# EAGLE design OpenBarbell3b2 (EAGLE 7.3.0)
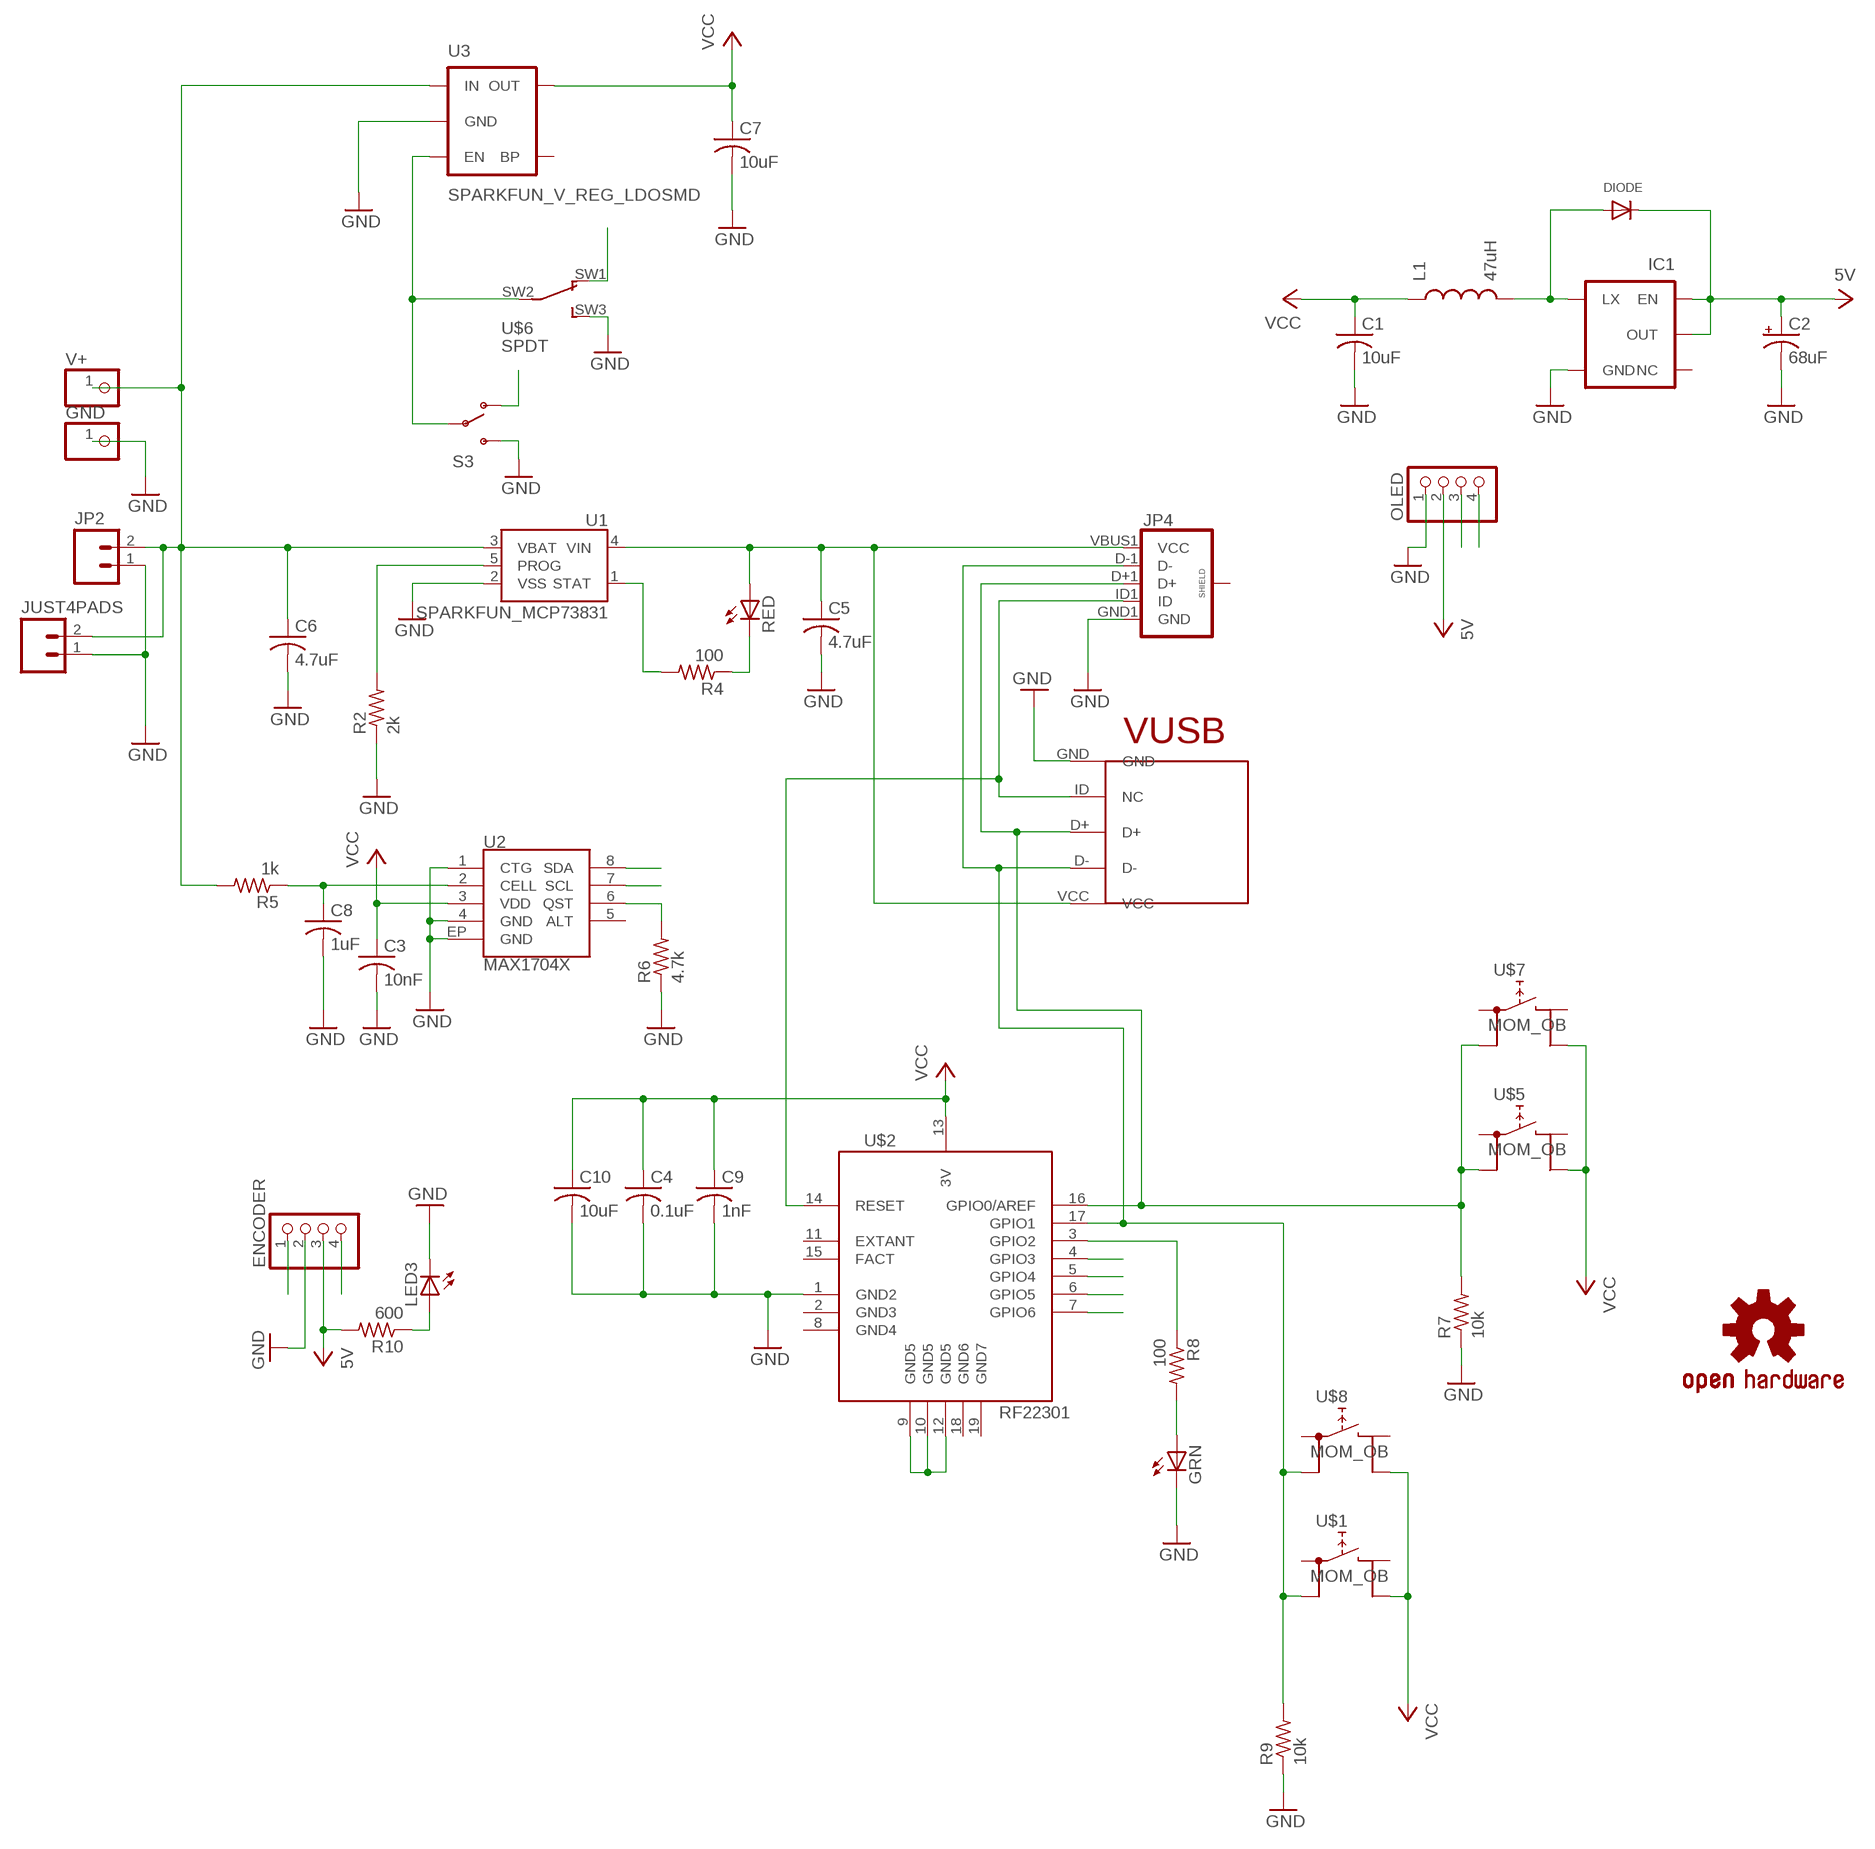
[diagram p0: schematic, sheet 1]

## Parts
C1  10uF  C-USC0805  [C0805]
C2  68uF  SPARKFUN_CAP_POL3528  [SPARKFUN_EIA3528]
C3  10nF  C-USC0805  [C0805]
C4  0.1uF  C-USC0805  [C0805]
C5  4.7uF  C-USC0805  [C0805]
C6  4.7uF  C-USC0805  [C0805]
C7  10uF  C-USC0805  [C0805]
C8  1uF  C-USC0805  [C0805]
C9  1nF  C-USC0805  [C0805]
C10  10uF  C-USC0805  [C0805]
DIODE  DIODESOD-123  [SOD-123]
ENCODER  PINHD-1X3CB  [1X03-CLEANBIG]
GND  PINHD-1X1  [1X01]
GRN  LEDCHIPLED_0805  [CHIPLED_0805]
IC1  SPARKFUN_V_REG_NCP1400SOT23-5  [SPARKFUN_SOT23-5]
JP2  SPARKFUN_M02-JST-2MM-SMT  [SPARKFUN_JST-2-SMD]
JP4  USB_MICROB_PLUGCONN-11752  [USB-B-MICRO-SMD_V03]
JUST4PADS  SPARKFUN_M02-JST-2MM-SMT  [SPARKFUN_JST-2-SMD]
L1  47uH  SPARKFUN_INDUCTORCR54  [SPARKFUN_CR54]
LED3  LED3MM  [LED3MM]
OLED  PINHD-1X3CB  [1X03-CLEANBIG]
R2  2k  R-US_R0805  [R0805]
R4  100  R-US_R0805  [R0805]
R5  1k  R-US_R0805  [R0805]
R6  4.7k  R-US_R0805  [R0805]
R7  10k  R-US_R0805  [R0805]
R8  100  R-US_R0805  [R0805]
R9  10k  R-US_R0805  [R0805]
R10  600  R-US_R0805  [R0805]
RED  LEDCHIPLED_0805  [CHIPLED_0805]
S3  SWITCH-SPDTSMD2  [SWITCH-SPDT-SMD]
U1  SPARKFUN_MCP73831  [SPARKFUN_SOT23-5]
U2  MAX1704X  [TDFN-8]
U3  SPARKFUN_V_REG_LDOSMD  [SPARKFUN_SOT23-5]
U$1  MOM_OB  [MOM_]
U$2  RF22301  [RFD22301]
U$3  USB-MICRO-B-VERTICAL_SMD  [USB-MICRO-B-VERTICAL-SMD]
U$4  SPARKFUN_OSHW-LOGOL  [SPARKFUN_OSHW-LOGO-L]
U$5  MOM_OB  [MOM_]
U$6  SPDT  [SPDT]
U$7  MOM_OB  [MOM_]
U$8  MOM_OB  [MOM_]
V+  PINHD-1X1  [1X01]

## Nets
5V: C2.A(+) DIODE.C ENCODER.3 IC1.1(EN) IC1.2(OUT) OLED.2 R10.2
12345: C6.1 JP2.2 JUST4PADS.2 R5.2 S3.1(O) U1.3(VBAT) U3.1(IN) U$6.SW1 V+.1
DIR: ENCODER.4 U$2.4(GPIO3)
GND: C1.2 C2.C(-) C3.2 C4.2 C5.2 C6.2 C7.2 C8.2 C9.2 C10.2 ENCODER.2 GND.1 GRN.C IC1.4(GND) JP2.1 JP4.GND1(GND) JUST4PADS.1 LED3.K(C) OLED.1 R2.1 R6.1 R7.1 R9.1 S3.3(S) U1.2(VSS) U2.1(CTG) U2.4(GND) U2.EP(GND) U3.2(GND) U$2.1(GND2) U$3.GND U$6.SW3
GND5: U$2.9(GND5) U$2.10(GND5) U$2.12(GND5)
N$4: R6.2 U2.6(QST)
N$5: DIODE.A IC1.5(LX) L1.P$2
N$6: LED3.A R10.1
N$7: C8.1 R5.1 U2.2(CELL)
N$8: C5.1 JP4.VBUS1(VCC) RED.A U1.4(VIN) U$3.VCC
N$9: R4.1 RED.C
N$10: R2.2 U1.5(PROG)
N$11: R4.2 U1.1(STAT)
N$12: GRN.A R8.2
N$13: R8.1 U$2.3(GPIO2)
N$14: S3.2(P) U3.3(EN) U$6.SW2
N$15: JP4.ID1(ID) U$2.14(RESET) U$3.ID(NC)
N$16: JP4.D+1(D+) R7.2 U$2.16(GPIO0/AREF) U$3.D+ U$5.T2 U$7.T2
N$17: JP4.D-1(D-) R9.2 U$1.T2 U$2.17(GPIO1) U$3.D- U$8.T2
SCL: OLED.3 U2.7(SCL) U$2.6(GPIO5)
SDA: OLED.4 U2.8(SDA) U$2.7(GPIO6)
TACH: ENCODER.1 U$2.5(GPIO4)
VCC: C1.1 C3.1 C4.1 C7.1 C9.1 C10.1 L1.P$1 U2.3(VDD) U3.5(OUT) U$1.T4 U$2.13(3V) U$5.T4 U$7.T4 U$8.T4
Unconnected: IC1.3(NC) JP4.SHIELD1(SHIELD) JP4.SHIELD2(SHIELD) JP4.SHIELD3(SHIELD) U2.5(ALT) U3.4(BP) U$1.T1 U$1.T3 U$2.11(EXTANT) U$2.15(FACT) U$5.T1 U$5.T3 U$7.T1 U$7.T3 U$8.T1 U$8.T3

## Power pins joined to a net without a drawn wire
GND3: U$2.2(GND3)
GND4: U$2.8(GND4)
GND6: U$2.18(GND6)
GND7: U$2.19(GND7)

## Library data of the parts
C1 C5-C7 C9 C10 = adafruit:C-US: CAPACITOR, American symbol; MPN: MC0805B102K101CT; OC_NEWARK: 33R0628
C2 = NCP1402_5V_step-up-v10:SPARKFUN_CAP_POL: Capacitor Polarized These are standard SMD and PTH capacitors. Normally 10uF, 47uF, and 100uF in electrolytic and tantalum varieties. Always verify the external diameter of the through hole cap, it varies with capacity, voltage, and manufacturer. The EIA devices should be standard.; MPN: T520B686M006ATE025; OC_NEWARK: 94W4852
C3 = adafruit:C-US: CAPACITOR, American symbol; MPN: MC0805B103M500CT; OC_NEWARK: 06R3737
C4 = adafruit:C-US: CAPACITOR, American symbol; MPN: MC0805B104M160CT; OC_NEWARK: 06R3744
C8 = adafruit:C-US: CAPACITOR, American symbol; MF: KEMET; MPN: C0805C105M4VACTU; OC_NEWARK: 64K2895
DIODE = adafruit:DIODE: Diode SMADIODE - SMA Surface Mount Package 20V 1A Schottky Diode Digikey: 641-1014-6-ND DO-1N4148 - Through Hole Small Current Diode SOD-123 20V 1 A (.5mV Vf) Schottky Diode - Digikey: MBRX120TPMSCT-ND SOD-323 10V 570mA (.38mV Vf, 3ns) Schottky Diode - Digikey: ZLLS410CT-ND SOD-523 30V 30mA Schottky Diode (RB751S-40TE61) - Digikey: RB751S-40TE61CT-ND SOT23-R/W - SOT23 Package (R = Solder Paste/Reflow Ovens, W = Hand-Soldering) BAT54Film 40V 300mA - Digikey: 497-7162-1-ND; OC_NEWARK: unknown
ENCODER OLED = OpenBarbell 1x4:PINHD-1X3: PIN HEADER; OC_NEWARK: unknown
GND V+ = adafruit:PINHD-1X1: Pin header 1x1 for 0.1" spacing With round pins; OC_NEWARK: unknown
GRN RED = led:LED: LED; OC_NEWARK: unknown
IC1 = NCP1402_5V_step-up-v10:SPARKFUN_V_REG_NCP1400: Switching step-up voltage regulator NCP1400 switiching regulator takes single cell AA and outputs 100mA at 3.3V or 5V with minimal number of external components.; MF: ON SEMICONDUCTOR; MPN: NCP1402SN33T1G; OC_NEWARK: 45J1846
JP2 JUST4PADS = LiPo-Shield-v13:SPARKFUN_M02: Header 2 Standard 2-pin 0.1" header. Use with straight break away headers (SKU : PRT-00116), right angle break away headers (PRT-00553), swiss pins (PRT-00743), machine pins (PRT-00117), and female headers (PRT-00115). Molex polarized connector foot print use with SKU : PRT-08233 with associated crimp pins and housings.; MF: FARNELL; MPN: S2B-PH-SM4-TB(LF)(SN); OC_NEWARK: 38K8067
JP4 = SparkFun-Connectors:USB_MICROB_PLUG: USB Micro-B connectors Some male, some female. Watch your step!; OC_NEWARK: unknown; PROD_ID: CONN-11752
L1 = NCP1402_5V_step-up-v10:SPARKFUN_INDUCTOR: Inductors Basic Inductor/Choke - 0603 and 1206. Footprints are not proven and vary greatly between part numbers.; MPN: SRF1280-470M; OC_NEWARK: 14T0991
LED3 = adafruit:LED: LED; MPN: MCL034SBLC; OC_NEWARK: 14N9384
R2 R6 = adafruit:R-US_: RESISTOR, American symbol; MPN: MCHP05W4F4701T5E; OC_NEWARK: 01N7037
R4 R8 = adafruit:R-US_: RESISTOR, American symbol; MPN: MCHP05W4F3300T5E; OC_NEWARK: 01N7024
R5 = adafruit:R-US_: RESISTOR, American symbol; MF: OUTSOURCE ITEM; MPN: RR1220P-102-D; OC_NEWARK: 28K0916
R7 R9 = adafruit:R-US_: RESISTOR, American symbol; MPN: MCHP05W4F1002T5E; OC_NEWARK: 01N6989
R10 = adafruit:R-US_: RESISTOR, American symbol; MPN: MMZ2012S601A; OC_NEWARK: 89R3122
S3 = SparkFun-Electromechanical:SWITCH-SPDT: SPDT Switch Simple slide switch, Spark Fun Electronics SKU : COM-00102 DPDT SMT slide switch, AYZ0202, SWCH-08179; OC_NEWARK: unknown
U1 = LiPo-Shield-v13:SPARKFUN_MCP73831: Microchip's MCP73831 Miniature single cell, fully integrated Li-Ion, Li-polymer charge management controller http://ww1.microchip.com/downloads/en/DeviceDoc/21984a.pdf; MPN: MCP73831T-2DCI/OT; OC_NEWARK: 84R6271
U2 = SparkFun-PowerIC:MAX1704X: MAX17043/MAX17044: Battery Fuel Guage (43 is 1cell, 44 is 2cell); OC_NEWARK: unknown; PROD-ID: IC-10399
U3 = LiPo-Shield-v13:SPARKFUN_V_REG_LDO: Voltage Regulator LDO Standard 150mA LDO voltage regulator in SOT-23 layout. Micrel part MIC5205. BP (by-pass) pin is used to lower output noise with 470pF cap.; MPN: MIC5205-3.3YM5 TR; OC_NEWARK: 26R6805
U$1 U$5 U$7 U$8 = 20151206_2341_OpenBarbellSwitches:MOM_
U$2 = GeekAmmo:RF22301: RFD22301 RFDuino Bluetooth 4.0 Low Energy BLE RF Module With Built-In ARM Cortex M0 Microconroller Hi performance, professional grade Bluetooth 4.0 Low Energy radio transceiver with built-in ARM Cortex M0 microcontroller that can be programmed using the simple-to-use Arduino IDE using RFduino extensions. Built-in user application microcontroller with ADC, I2C, SPI, UART and GPIO. http://www.rfduino.com/; OC_NEWARK: unknown
U$3 = USB3131-30-0230-A:USB-MICRO-B-VERTICAL_SMD
U$4 = NCP1402_5V_step-up-v10:SPARKFUN_OSHW-LOGO: Open Source Hardware Logo This logo indicates the piece of hardware it is found on incorporates a OSHW license and/or adheres to the definition of open source hardware found here: http://freedomdefined.org/OSHW; OC_NEWARK: unknown
U$6 = 20151206_2341_OpenBarbellSwitches:SPDT

## Net classes
0 default: width 0.203 mm, drill 0.508 mm, clearance 0.152 mm

## Board
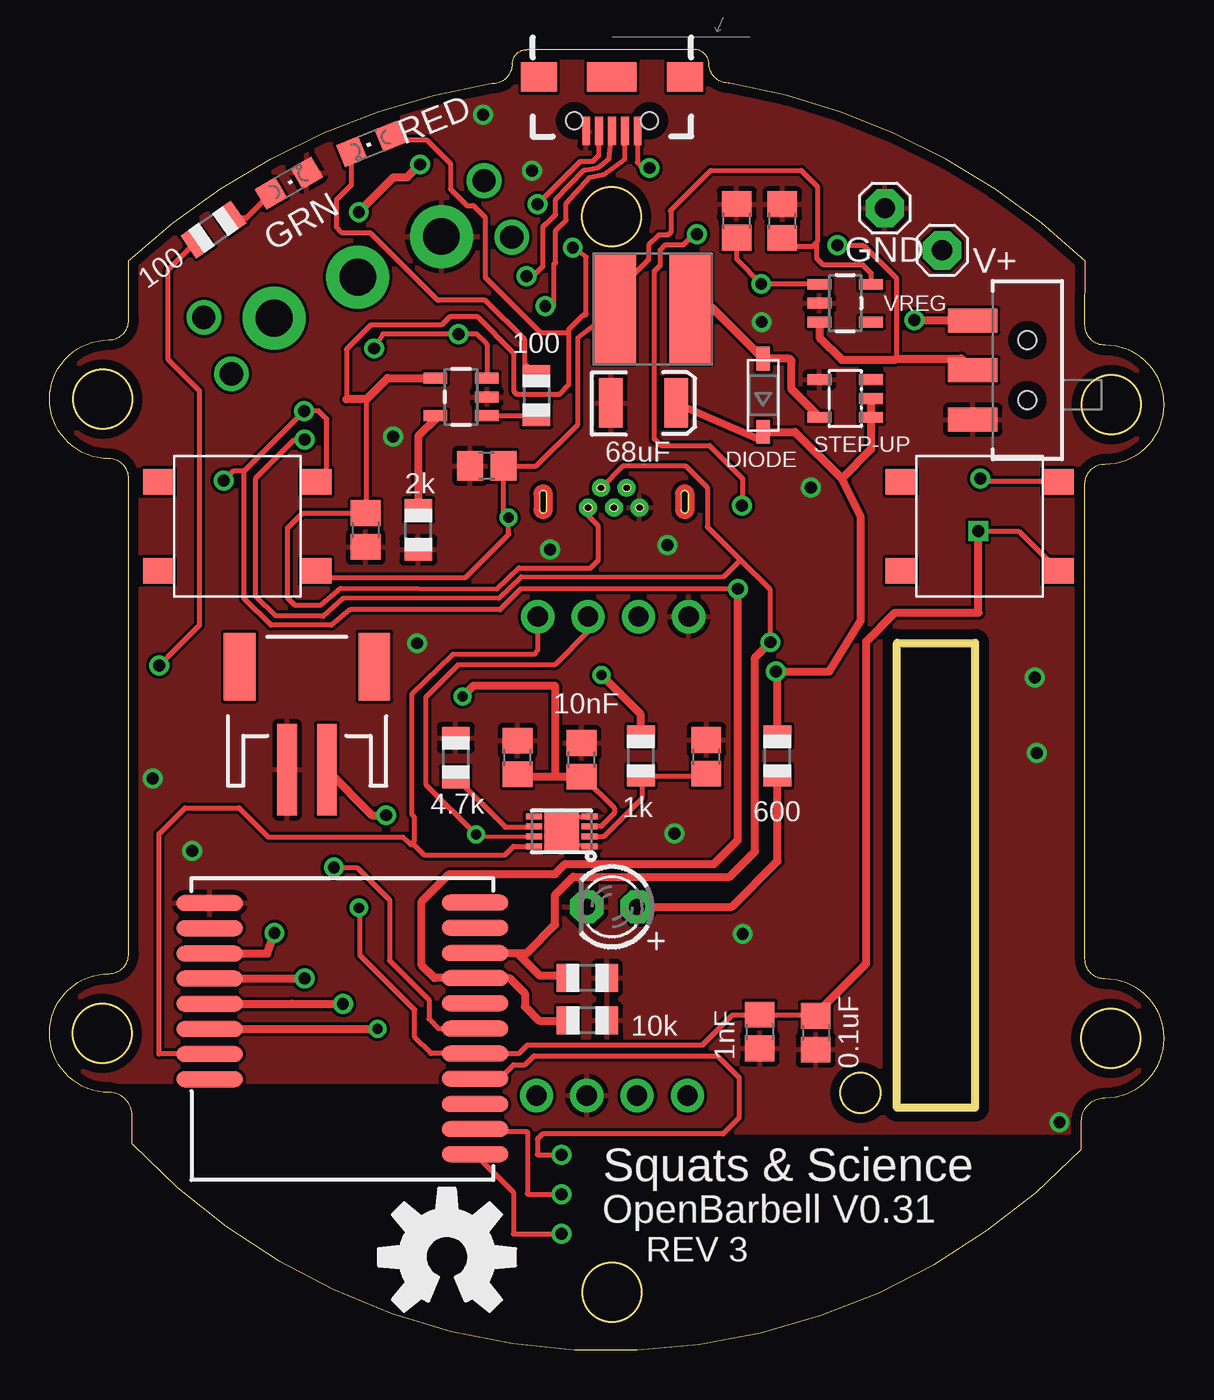
[diagram p1: board, top side]
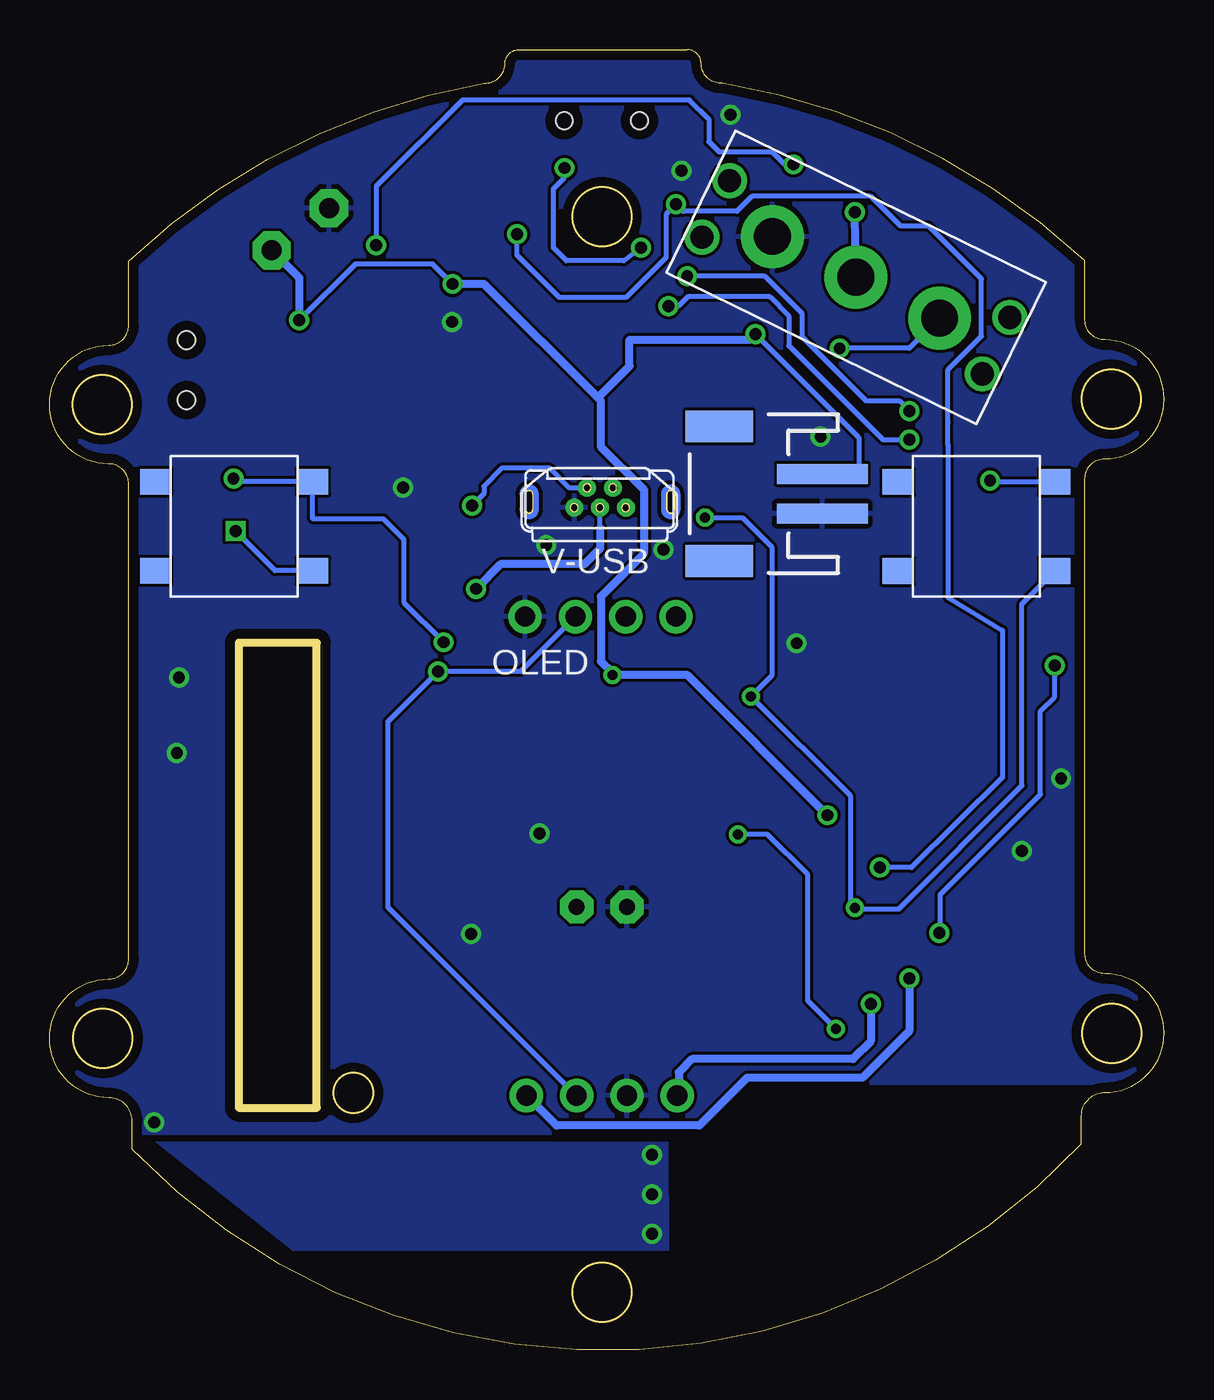
[diagram p2: board, bottom side, seen from below]

Size 56.29 x 65.66 mm. Coordinates in mm from the lower left corner, seen from the top.
Outline: 4.18,10.41 arc93 52.11,10.14 52.11,11.55 arc-90 53.29,12.73 arc90 56.29,15.73 arc90 53.29,18.73 arc-90 52.29,19.73 52.29,43.73 arc-90 53.29,44.73 arc90 56.29,47.73 arc90 53.29,50.73 arc-90 52.29,51.73 52.29,54.97 arc34 34.34,63.96 arc-90 33.29,64.94 arc90 32.57,65.66 24.1,65.66 arc90 23.38,64.94 arc-90 22.4,63.96 22.32,63.96 arc34 4,55 4,52 arc-90 3,51 arc90 0,48 arc90 3,45 arc-90 4,44 4,20 arc-90 3,19 arc90 0,16 arc90 3,13 arc-90 4.18,11.82 4.18,10.41
Outline: circle at 28.38,57.21 radius 1.49
Outline: circle at 2.68,48 radius 1.49
Outline: circle at 2.66,15.99 radius 1.49
Outline: circle at 28.4,2.9 radius 1.49
Outline: circle at 53.59,15.73 radius 1.49
Outline: circle at 53.62,47.74 radius 1.49
Outline: circle at 40.94,12.98 radius 1
Copper layers (1*16): Top 0.035mm / dielectric 1.5mm / Bottom 0.035mm
Design rules "default *": minimum track width 6mil, minimum drill 20mil, track to track 6mil, track to pad 6mil, pad to pad 6mil, via to via 6mil, smd to smd 6mil, copper to edge 20mil, drill to drill 8mil, minimum pad ring 10mil, minimum via ring 8mil, stop-mask expansion 2mil, vias tented up to drill 0mil, thermal gap 10mil
Milling: area 42.8,12.2 to 46.7,35.7

### Footprints (pad centres in the part's own frame; a part is rotated, then mirrored left to right if it is on the bottom)
C0805 = smd 1.3 x 1.5: 1 -0.85,0; 2 0.85,0
SPARKFUN_EIA3528 = smd 1.2 x 2.5: A 1.65,0; C -1.65,0
SOD-123 = smd 1.2 x 0.7: A 1.85,0; C -1.85,0
1X03-CLEANBIG = drill 1.016 pad 1.676: 1 -2.54,0; 2 0,0; 3 2.54,0; 4 5.08,0
1X01 = drill 1.016 pad 1.93 octagon: 1 0,0
CHIPLED_0805 = smd 1.2 x 1.2: A 0,-1.05; C 0,1.05
SPARKFUN_SOT23-5 = smd 0.55 x 1.2: 1 -0.95,-1.3; 2 0,-1.3; 3 0.95,-1.3; 4 0.95,1.3; 5 -0.95,1.3
SPARKFUN_JST-2-SMD = smd 1 x 4.6: 1 -1,-3.7; 2 1,-3.7 | smd 1.6 x 3.4: NC1 -3.4,1.5; NC2 3.4,1.5
USB-B-MICRO-SMD_V03 = smd 1.45 x 0.4: D+1 2.725,0; D-1 2.725,0.65; GND1 2.725,-1.3; ID1 2.725,-0.65; VBUS1 2.725,1.3 | smd 1.5 x 1.8: SHIELD1 0,3.685; SHIELD2 0,-3.685 | smd 1.5 x 2.5: SHIELD3 0,0 | hole 0.85: 2.2,1.9; 2.2,-1.9
SPARKFUN_CR54 = smd 5.5 x 2.15: P$1 0,1.92; P$2 0,-1.92
LED3MM = drill 0.813 pad 1.676 octagon: A -1.27,0; K 1.27,0
R0805 = smd 1.1 x 1.4: 1 -1,0; 2 1,0
SWITCH-SPDT-SMD = smd 1.2 x 2.5: 1 -2.5,-2.75; 2 0,-2.75; 3 2.5,-2.75 | hole 0.9: -1.518,0; 1.518,0
TDFN-8 = smd 0.8 x 0.3: 1 -1.4,0.75; 2 -1.4,0.25; 3 -1.4,-0.25; 4 -1.4,-0.75; 5 1.4,-0.75; 6 1.4,-0.25; 7 1.4,0.25; 8 1.4,0.75 | smd 1.73 x 1.88: EP 0,0
MOM_ = smd 1.549 x 1.295: T1 0,0; T2 7.95,0; T3 0,-4.496; T4 7.95,-4.496
RFD22301 = smd 3.353 x 0.813: 1 0,0; 2 0,-1.27; 3 0,-2.54; 4 0,-3.81; 5 0,-5.08; 6 0,-6.35; 7 0,-7.62; 8 0,-8.89; 9 13.411,-12.675; 10 13.411,-11.405; 11 13.411,-10.135; 12 13.411,-8.865; 13 13.411,-7.595; 14 13.411,-6.325; 15 13.411,-5.055; 16 13.411,-3.785; 17 13.411,-2.515; 18 13.411,-1.245; 19 13.411,0.025
USB-MICRO-B-VERTICAL-SMD = drill 0.4: D+ -0.01,0.48; D- -0.66,-0.52; GND 1.29,0.48; ID 0.64,-0.52; VCC -1.31,0.48
SPDT = drill 1.168 pad 1.676: M1 0,0; M2 3.175,0; M3 0,-15.748; M4 3.175,-15.748 | drill 1.854 pad 3.175: SW1 1.587,-3.175; SW2 1.587,-7.874; SW3 1.587,-12.573

### Placement (x,y rotation side)
C1  22.08,44.64 180 top
C2  29.99,47.82 0 top
C3  26.87,29.79 90 top
C4  38.69,16.02 270 top
C5  15.96,41.4 270 top
C6  34.69,57.01 90 top
C7  37,57 90 top
C8  33.16,29.94 90 top
C9  35.86,16.08 270 top
C10  23.63,29.91 90 top
DIODE  36.03,48.2 90 top
ENCODER  27.13,12.85 0 top
GND  42.18,57.65 0 top
GRN  12.08,58.91 300 top
IC1  40.18,48.04 90 top
JP2  20.97,43.23 90 bottom
JP4  28.4,64.27 270 top
JUST4PADS  13,33 0 top
L1  30.45,52.56 90 top
LED3  28.4,22.37 180 top
OLED  29.73,37.02 0 bottom
R2  18.62,41.41 90 top
R4  24.58,48.19 270 top
R5  29.86,29.99 90 top
R6  20.51,29.91 270 top
R7  27.16,16.64 180 top
R8  8.28,56.57 35 top
R9  27.15,18.79 180 top
R10  36.75,29.99 90 top
RED  16.22,60.89 112 top
S3  49.37,49.47 270 top
U1  20.78,48.12 90 top
U2  25.86,26.18 180 top
U3  40.18,52.85 270 top
U$1  50.94,43.84 0 bottom
U$2  8.08,22.56 0 top
U$3  28.5,43.01 180 bottom
U$4  20.07,4.69 0 top
U$5  13.47,43.83 0 bottom
U$6  7.79,52.14 244 bottom
U$7  5.51,43.83 0 top
U$8  42.99,43.84 0 top
V+  45.07,55.52 0 top

### Tracks (layer width: path | path; a pad name or v marks a point on that pad's centre or on a via)
5V  (via drill 0.6)
  Top 0.406: C2.A 35.72,46.04 DIODE.C 37.65,46.35 40,44 | 40,44 40.96,42.04 40.96,36.83 39.39,34.26 v36.67,34.26 36.75,34.18 R10.2 | IC1.2 IC1.1 41.48,45.48 40,44
  Bottom 0.203: 29.67,12.87 ENCODER.3
  Bottom 0.254: OLED.2 32.5,34.26 v36.67,34.26 39.21,31.72 39.21,22.36 29.7,12.85 ENCODER.3
12345  (via drill 0.51, 0.6)
  Top 0.16: U3.1 38.85,53.83 | v35.93,53.83 36.02,53.91
  Top 0.203: 22.02,49.19 U1.3
  Top 0.254: U1.3 22.08,50.78 21.57,51.29 v20.65,51.29 16.84,51.29 v16.39,50.57 | C6.1 34.69,55.06 v35.93,53.83 38.85,53.83 | 43.7,51.97 v43.68,51.99
  Top 0.406: R5.2 29.86,32.08 v27.87,34.07 | JUST4PADS.2 16.3,27 v17,27 | S3.1 43.7,51.97
  Bottom 0.254: v35.93,53.83 36.93,54.83 40.84,54.83 v43.68,51.99 | v20.65,51.29 15.42,46.06 15.42,44.2 15.45,44.23 JP2.2 | U$6.SW1 12.87,50.57 v16.39,50.57
  Bottom 0.406: 28.6,48.08 27,49.68 27,51 20.95,51 v20.65,51.29 | 28.6,48.08 34.35,53.83 v35.93,53.83 | 28.6,48.08 28.46,47.93 28.46,45.62 | v17,27 24.07,34.07 v27.87,34.07 27.87,34.19 28.46,34.78 28.45,34.79 28.45,38.05 26.25,40.25 26.25,43.41 28.46,45.62 | 28.45,45.63 28.46,45.62 | V+.1 43.68,54.13 v43.68,51.99
DIR  (via drill 0.6)
  Top 0.203: 32.16,12.87 ENCODER.4
  Top 0.406: U$2.4 12.86,18.75 v12.88,18.77
  Bottom 0.406: ENCODER.4 30.7,11.33 23.47,11.33 21.06,13.74 15.24,13.74 12.88,16.11 v12.88,18.77
GND  (via drill 0.6)
  Top 0.203: 26.11,25.85 25.94,26.03 U2.EP | 26.11,25.85 26.47,25.49 27.18,25.49 U2.1 27.36,25.32 | 26.11,26.38 25.94,26.21 U2.EP | 26.11,26.38 26.65,26.92 27.18,26.92 U2.4 | 26.11,26.38 U2.EP | 26.11,25.85 U2.EP | 27.18,12.69 ENCODER.2 | 27.18,22.29 LED3.K
  other vias: 49.86,30.15 38.44,43.55 18.56,35.68 49.75,33.96 35.96,51.91 21.9,62.37 51,11.5 31.55,26.09 35,21 7.2,25.19 24.37,59.54 17.35,46.12 31.2,40.65 25.28,40.42 5.21,28.86
  cutout Bottom: 42.79,35.71 46.73,35.71 46.73,12.29 42.79,12.29
  pour Top: 58,66 -1.01,66 -1.01,13.56 19.64,13.56 19.64,13.45 19.71,13.45 19.71,11.02 57.06,11.02 57.06,11.2 58,11.2
  pour Bottom: -1,66 57,66 57,11 19.93,11 19.93,13.51 -1.38,13.51 -1.38,14.44 -1,14.44
GND5  (via drill 0.6)
  Top 0.203: 20.42,9.67 21.49,9.67
  Top 0.254: 21.49,9.67 U$2.9 23.42,7.96 23.42,5.84 23.44,5.86 v25.86,5.86 | U$2.12 22.71,13.7 23.42,14.4 24.01,14.4 24.47,14.86 33.72,14.86 34.82,13.76 34.82,11.72 34.01,10.91 24.9,10.91 24.64,10.65 24.64,9.86 v25.86,9.86 | U$2.10 21.62,11.03 24.11,11.03 24.13,11.01 24.13,7.89 24.16,7.86 v25.86,7.86
  pour Bottom: 25.02,10.51 25.01,5 32,5 44,5 50.94,10.51
N$1
  cutout Top: 42.79,35.71 46.72,35.71 46.73,12.29 42.79,12.29
  cutout Top: 42.79,35.71 46.72,35.71 46.73,12.29 42.79,12.29
N$4
  Top 0.16: 23,26.38 23,26.42
  Top 0.203: 24.34,26.38 U2.6
  Top 0.254: 24.34,26.38 23,26.38 | 23,26.42 R6.2
N$5
  Top 0.16: IC1.5
  Top 0.406: IC1.5 37.47,48.51 37.47,49.94 37.36,50.05 DIODE.A 33.12,52.96 L1.P$2
N$6
  Top 0.406: LED3.A 34.45,22.37 36.76,24.68 36.76,28.98 R10.1
N$7
  Top 0.254: U2.2 27.99,25.93 29.94,27.88 29.94,28.91 R5.1 33.06,28.99 C8.1
N$8  (via drill 0.6)
  Top 0.203: 19.36,49.19 U1.4
  Top 0.254: 15,48 15,50.53 16.22,51.75 19.79,51.75 20.21,52.17 21.61,52.17 23.47,50.31 23.47,48.38 23.6,48.24 25.74,48.24 26.23,48.73 26.23,51.36 | U$3.VCC 27.19,42.12 27.71,41.6 27.71,39.88 27.32,39.49 23.69,39.49 22.57,38.42 14.71,38.46 13.7,37.61 12.39,37.61 12,38 12,41.48 12.77,42.25 C5.1 16,42.29 16,48 | 26.23,51.36 26.23,51.54 26.95,52.26 27.04,52.26 27.09,52.31 27.09,55.19 v26.42,55.65 | JP4.VBUS1 29.68,61.47 29.68,59.95 29.95,59.68 v30.29,59.68 | RED.A 17.38,61.1 19.04,61.1 20.25,59.89 20.25,58.61 21.08,57.78 21.41,57.78 22,57.19 22,54.16 24.8,51.36 26.23,51.36
  Top 0.406: U1.4 17.07,49.07 16,48 15,48
  Bottom 0.254: v26.42,55.65 27.29,54.99 30.19,54.99 30.85,55.65 30.85,58.63 30.29,59.19 v30.29,59.68
N$9
  Top 0.254: R4.1 24,49.77 24,51 22,53 19.6,53 16.21,56.39 14.78,56.39 14.49,56.68 14.49,58.07 15.25,58.83 RED.C
N$10
  Top 0.203: 19.54,47.05 U1.5
  Top 0.406: 19.54,47.05 18.62,46.14 R2.2
N$11
  Top 0.254: U1.1 24.57,47.17 R4.2
N$12
  Top 0.254: GRN.A 9.93,57.14 R8.2
N$13  (via drill 0.6)
  Top 0.254: v5.53,34.55 7.58,36.6 7.58,48.42 6,50 6,54.53 R8.1
  Top 0.406: U$2.3 11,20.02 | 11,20.02 11,20 | 11,20.02 v11.36,21.06
  Bottom 0.254: v11.36,21.06 11.32,21.09 11.32,22.98 6.25,28.06 6.25,32.25 5.53,32.97 v5.53,34.55
N$14  (via drill 0.6)
  Top 0.254: v39.79,55.78 41.09,55.78 42.76,54.11 42.76,50.06
  Top 0.406: 46.09,50 S3.2 46.03,50.06 42.76,50.06 42.71,50 40,50 38.88,51.12 U3.3 | v15.62,57.45 17.37,59.21 18.06,59.21 v18.71,59.86
  Bottom 0.254: v39.79,55.78 39.79,58.76 35.44,63.11 23.97,63.11 23,62.14 23,61 22.49,60.49 19.81,60.49 19.18,59.86 v18.71,59.86
  Bottom 0.406: U$6.SW2 v15.62,57.45
N$15  (via drill 0.6)
  Top 0.254: v14.36,24.36 15.53,24.36 17.16,22.73 17.16,19.66 19.16,17.67 19.16,16.71 19.63,16.24 U$2.14 | U$2.14 | v34.96,42.63 35,42.67 35,44 33.33,45.67 30.86,45.67 30.54,45.99 30.54,54.44 30.53,54.45 30.84,54.76 30.84,55.54 31.1,55.8 32.01,55.8 32.54,56.33 v32.68,56.33 | v24.65,57.86 26.8,60.02 27.44,60.02 27.74,60.32 27.74,61.54 JP4.ID1
  Bottom 0.254: v14.36,24.36 12.76,24.36 8.16,28.9 8.16,36.33 10.92,37.98 10.93,45.73 10.92,46.82 10.92,49.49 9.23,51.18 9.23,54.09 11.89,56.75 13.31,56.75 14.82,58.25 20.81,58.25 21.57,57.5 24.29,57.5 v24.65,57.86 25.16,57.35 25.16,55.16 27.18,53.14 30.54,53.14 32.68,55.28 v32.68,56.33 | U$3.ID 30.04,43.53 31.02,44.52 33.45,44.52 34.35,43.61 34.35,43.23 v34.96,42.63
N$16  (via drill 0.6)
  Top 0.254: v34.76,38.43 23.79,38.43 22.76,37.38 15.18,37.37 14.24,36.6 11.18,36.6 9.83,37.95 9.83,44.37 | 9.83,44.37 v12.87,47.41 13.59,47.41 14,47 14,44.37 U$7.T2 | JP4.D+1 28.26,60.16 27.69,59.7 27,59.57 25.56,58.09 25.56,57.33 25.09,56.86 25.08,56.87 24.9,56.69 24.9,54.7 24.41,54.21 v24.09,54.21 | 9.83,44.37 9.28,44.37 v8.8,43.89
  Top 0.406: R7.2 26.14,16.62 24.73,16.62 24,17.34 24,18 23.23,18.78 U$2.16 19.44,18.78 18.79,19.42 18.79,22.64 20.18,24.03 25.53,24.03 26.04,24.54 33.55,24.54 34.76,25.75 v34.76,38.43
  Bottom 0.254: 28.49,41.49 U$3.D+ | v12.87,47.41 13.38,47.93 15.07,47.93 18.3,51.16 18.3,52.35 20.16,54.21 v24.09,54.21 | U$5.T2 8.74,43.83 v8.8,43.89
  Bottom 0.406: 28.48,41.5 28.49,41.49 28.49,40.47 29.27,39.68 33.51,39.68 v34.76,38.43
N$17  (via drill 0.6)
  Top 0.254: v36.4,35.73 36.4,38.38 34.89,39.89 | 34.89,39.89 33.22,41.56 33.22,43.54 32.11,44.65 28.96,44.65 U$3.D- | v12.88,45.96 12.36,45.96 10.42,44.02 10.42,38.05 11.43,37.07 13.84,37.05 14.86,37.96 22.69,37.95 23.82,39.04 34.05,39.05 34.89,39.89 | JP4.D-1 29.05,60.12 28.02,59.36 27.29,59.21 26.08,57.87 26.08,57.05 25.56,56.53 25.56,54.91 25.46,54.81 25.46,53.8 25.46,52.71 v25.03,52.71 | U$8.T2 47.16,43.84 v47,44
  Top 0.406: U$2.17 23.6,20.05 | 23.6,20.05 24.74,18.9 26.03,18.9 R9.2 | 23.6,20.05 24.1,20.05 25.53,21.48 25.53,22.98 26.43,23.89 34.34,23.89 35.63,25.17 35.63,34.97 v36.4,35.73
  Bottom 0.254: v36.4,35.73 38.41,37.74 38.41,40.94 39.42,41.95 42.99,41.95 U$1.T2 46.84,43.84 v47,44 | v12.88,45.96 14.21,45.96 18.95,50.71 18.95,52.21 19.92,53.17 24.06,53.17 24.51,52.72 v25.03,52.71
SCL  (via drill 0.51)
  Top 0.203: v21.53,26.03 21.63,25.93 U2.7
  Top 0.254: OLED.3 27.19,36.26 25.52,34.59 20.64,34.59 18.99,32.95 18.99,28.56 v21.53,26.03
  Top 0.406: U$2.6 14.2,16.21 v16.57,16.21
  Bottom 0.254: v16.57,16.21 18,17.63 18,24 20.03,26.03 v21.53,26.03
SDA
  Top 0.203: 24.45,25.42 U2.8
  Top 0.254: U$2.7 5.53,14.94 5.53,26.06 6.84,27.37 9.58,27.37 11.05,25.9 17.86,25.9 18.24,25.52 | 18.24,25.52 18.39,25.52 18.91,25 23,25 23.43,25.43 U2.8 | OLED.4 24.65,35.34 24.48,35.12 20.37,35.12 18.29,33.09 18.29,27.05 18.4,26.94 18.4,25.67 18.24,25.52
TACH  (via drill 0.6)
  Top 0.406: U$2.5 12.24,17.48 v14.81,17.48
  Bottom 0.406: 24.57,12.87 ENCODER.1 24.51,12.93 24.51,14.02 23.84,14.69 15.71,14.69 14.81,15.59 v14.81,17.48
VCC  (via drill 0.51, 0.6)
  Top 0.16: U3.5
  Top 0.203: 27.36,26.38 U2.3
  Top 0.254: v15.62,22.33 15.68,22.27 15.68,19.93 18.44,17.17 18.44,15.79 19.27,14.97 U$2.13 23.7,14.97 24.13,15.4 32.97,15.4 34.48,16.91 35.84,16.91 C9.1 38.63,16.93 C4.1 38.69,16.96 | 38.76,55.94 38.76,55.1 39.08,54.78 41.07,54.78 41.48,54.37 U3.5 | 38.76,55.94 38.77,55.95 38.77,58.73 37.94,59.56 33.38,59.55 31.35,57.52 31.37,57.49 31.37,56.43 31.23,56.29 30.77,56.29 30.25,55.77 30.25,55.04 28.53,53.32 L1.P$1 26.67,51.1 26.67,46.73 24.57,44.64 C1.1 22.93,42.28 v23.18,42.03 23.18,41.18 21,39 13.79,39 U$7.T4 | 37.43,55.72 38.54,55.72 38.76,55.94 | C3.1 26.95,28.94 28.53,27.36 28.53,27.1 27.84,26.42 U2.3 | v46.89,41.34 48.94,41.34 U$8.T4
  Top 0.406: 28.55,52.99 L1.P$1 28.19,52.96 | C3.1 25.51,28.94 | 25.51,28.94 25.52,28.95 25.52,33.53 21.39,33.53 v20.86,33 | 25.51,28.94 23.75,28.94 C10.1 | v46.89,41.34 46.9,37.23 42.7,37.22 41.25,35.77 41.25,19.51 38.69,16.96 | 37.43,55.72 C7.1
  Bottom 0.254: U$5.T4 7.18,37.67 7.18,28.49 13.4,22.27 15.56,22.27 v15.62,22.33 15.85,22.56 15.85,27.99 v20.86,33 19.81,34.05 19.81,40.53 21.31,42.03 v23.18,42.03 | U$1.T4 44.9,39.34 v46.89,41.34

### Text on the board
tPlace: Squats & Science | OpenBarbell V0.31 | REV 3
tNames: VREG | STEP-UP
tDocu: CUT OUT